# EAGLE design TX (EAGLE 7.3.0)
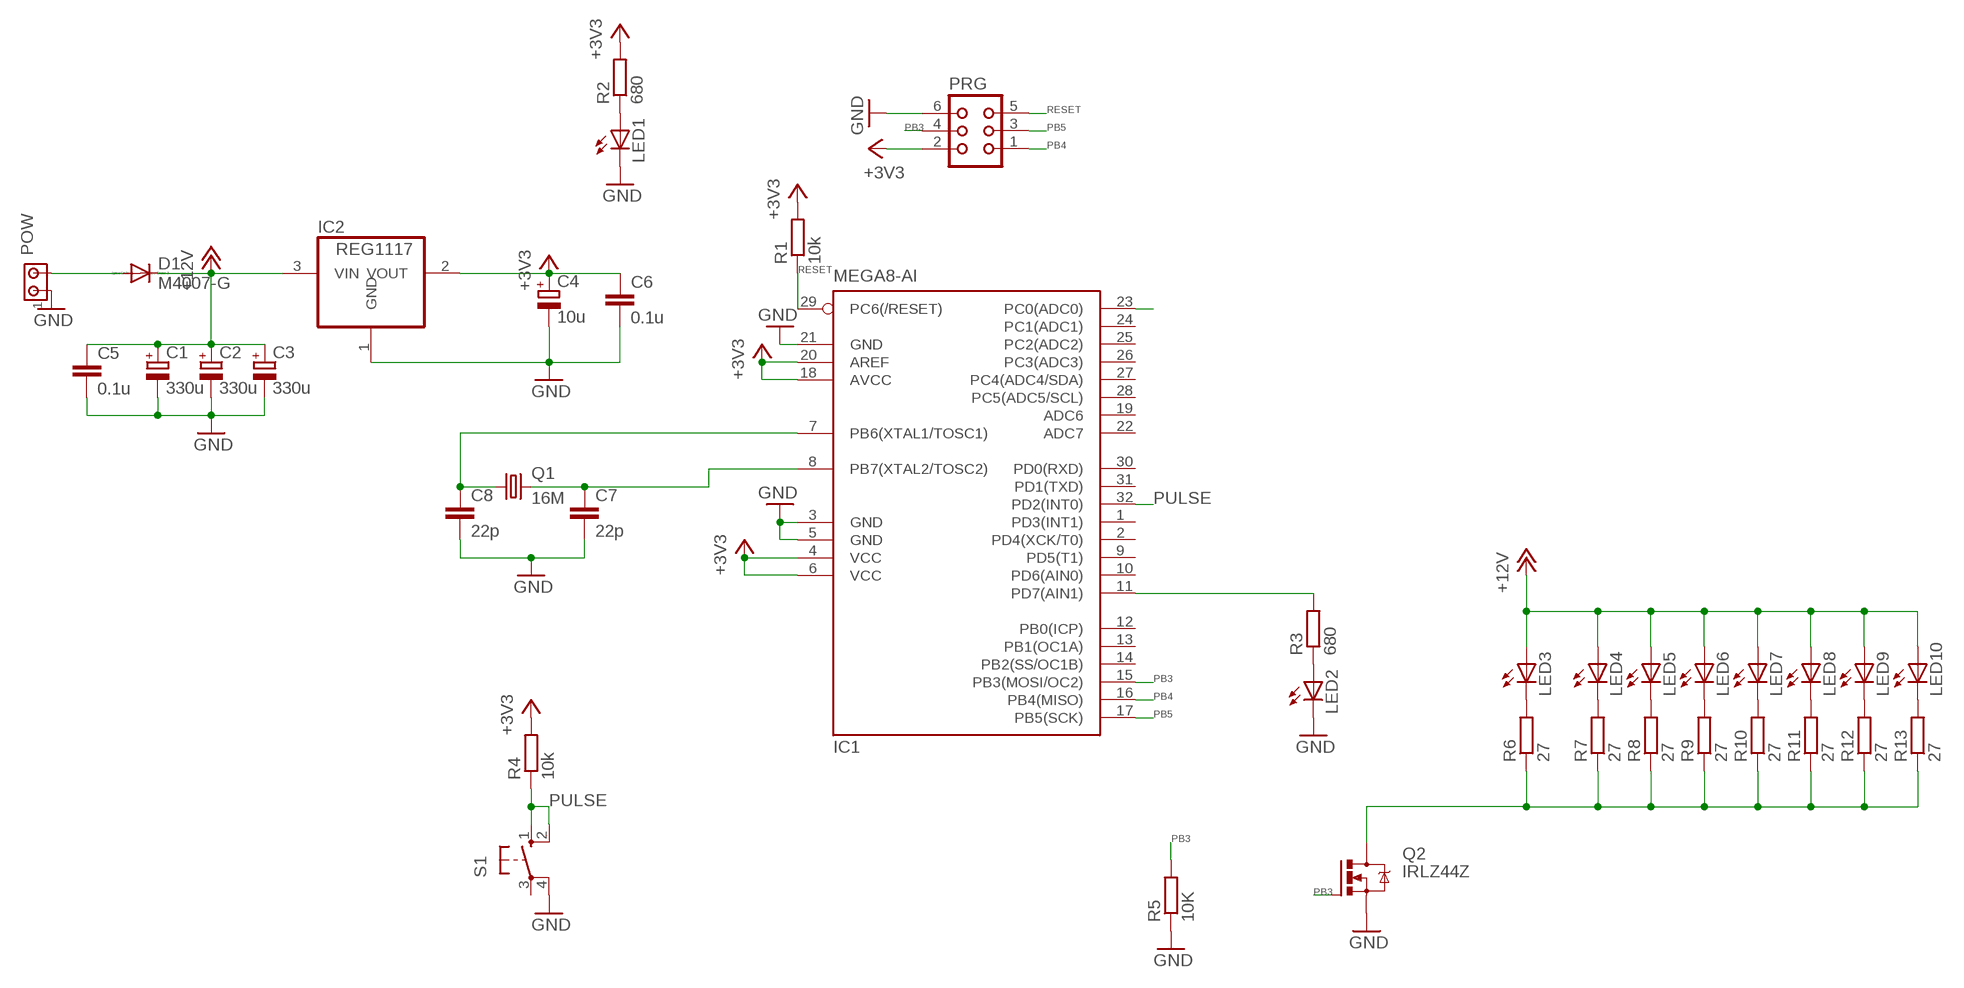
[diagram p0: schematic, sheet 1]

## Parts
C1  330u  CPOL-EU140CLH-1010  [140CLH-1010]
C2  330u  CPOL-EU140CLH-1010  [140CLH-1010]
C3  330u  CPOL-EU140CLH-1010  [140CLH-1010]
C4  10u  CPOL-EU140CLH-0810  [140CLH-0810]
C5  0.1u  C-EUC0402  [C0402]
C6  0.1u  C-EUC0402  [C0402]
C7  22p  C-EUC0805  [C0805]
C8  22p  C-EUC0805  [C0805]
D1  M4007-G  CGRM4007-G  [SOD-123_MINI-SMA]
IC1  MEGA8-AI  [TQFP32-08]
IC2  REG1117  [SOT223]
LED1  LED5MM  [LED5MM]
LED2  LED5MM  [LED5MM]
LED3  LED5MM  [LED5MM]
LED4  LED5MM  [LED5MM]
LED5  LED5MM  [LED5MM]
LED6  LED5MM  [LED5MM]
LED7  LED5MM  [LED5MM]
LED8  LED5MM  [LED5MM]
LED9  LED5MM  [LED5MM]
LED10  LED5MM  [LED5MM]
POW  MTA02-100  [10X02MTA]
PRG  CON06  [CON06]
Q1  16M  CRYSTALHC49UP  [HC49UP]
Q2  IRLZ44Z  [TO220BH]
R1  10k  R-EU_M1206  [M1206]
R2  680  R-EU_M1206  [M1206]
R3  680  R-EU_M1206  [M1206]
R4  10k  R-EU_M1206  [M1206]
R5  10K  R-EU_M1206  [M1206]
R6  27  R-EU_0204/7  [0204/7]
R7  27  R-EU_0204/7  [0204/7]
R8  27  R-EU_0204/7  [0204/7]
R9  27  R-EU_0204/7  [0204/7]
R10  27  R-EU_0204/7  [0204/7]
R11  27  R-EU_0204/7  [0204/7]
R12  27  R-EU_0204/7  [0204/7]
R13  27  R-EU_0204/7  [0204/7]
S1  10-XX  [B3F-10XX]

## Nets
+3V3: C4.+ C6.1 IC1.4(VCC) IC1.6(VCC) IC1.18(AVCC) IC1.20(AREF) IC2.2(VOUT) PRG.2 R1.2 R2.2 R4.2
+12V: C1.+ C2.+ C3.+ C5.1 D1.C IC2.3(VIN) LED3.A LED4.A LED5.A LED6.A LED7.A LED8.A LED9.A LED10.A
GND: C1.- C2.- C3.- C4.- C5.2 C6.2 C7.2 C8.2 IC1.3(GND) IC1.5(GND) IC1.21(GND) IC2.1(GND) LED1.K(C) LED2.K(C) POW.1 PRG.6 Q2.S R5.1 S1.4(P1)
N$1: LED3.K(C) R6.2
N$2: LED1.A R2.1
N$3: IC1.11(PD7(AIN1)) R3.2
N$4: LED2.A R3.1
N$5: LED4.K(C) R7.2
N$6: C8.1 IC1.7(PB6(XTAL1/TOSC1)) Q1.1
N$7: C7.1 IC1.8(PB7(XTAL2/TOSC2)) Q1.2
N$8: LED5.K(C) R8.2
N$9: LED6.K(C) R9.2
N$10: LED7.K(C) R10.2
N$11: LED8.K(C) R11.2
N$12: LED9.K(C) R12.2
N$13: LED10.K(C) R13.2
N$14: IC1.23(PC0(ADC0))
N$15: Q2.D R6.1 R7.1 R8.1 R9.1 R10.1 R11.1 R12.1 R13.1
N$16: D1.A POW.2
PB3: IC1.15(PB3(MOSI/OC2)) PRG.4 Q2.G R5.2
PB4: IC1.16(PB4(MISO)) PRG.1
PB5: IC1.17(PB5(SCK)) PRG.3
PULSE: IC1.32(PD2(INT0)) R4.1 S1.1(S) S1.2(S1)
RESET: IC1.29(PC6(/RESET)) PRG.5 R1.1
Unconnected: IC1.1(PD3(INT1)) IC1.2(PD4(XCK/T0)) IC1.9(PD5(T1)) IC1.10(PD6(AIN0)) IC1.12(PB0(ICP)) IC1.13(PB1(OC1A)) IC1.14(PB2(SS/OC1B)) IC1.19(ADC6) IC1.22(ADC7) IC1.24(PC1(ADC1)) IC1.25(PC2(ADC2)) IC1.26(PC3(ADC3)) IC1.27(PC4(ADC4/SDA)) IC1.28(PC5(ADC5/SCL)) IC1.30(PD0(RXD)) IC1.31(PD1(TXD)) S1.3(P)

## Library data of the parts
C1-C4 = rcl:CPOL-EU: POLARIZED CAPACITOR, European symbol
C5-C8 = rcl:C-EU: CAPACITOR, European symbol
D1 = diode:CGRM400*-G: Molded plasitc,JEDEC SOD-123/Mini SMA Source: Comchip CGRM4001-G.pdf
IC1 = atmel:MEGA8: MICROCONTROLLER 8 Kbytes FLASH, 1 kbytes SRAM, 512 bytes EEPROM, USART, 6-channel 10 bit ADC, 2-channel 8 bit ADC Pin compatible with Atmega48, ATMega88, ATMega168 Source: avr.lbr; MPN: ATMEGA8-16AU; OC_FARNELL: 9171371; OC_NEWARK: 73M8863
IC2 = burr-brown:REG1117: 800mA and 1A Low Dropout (LDO) Positive Regulator 1.8V, 2.5V, 2.85V, 3.3V, 5V, and Adj; MPN: REG1117; OC_FARNELL: 1097566; OC_NEWARK: 14P6981
LED1-LED10 = led:LED: LED OSRAM: - CHIPLED LG R971, LG N971, LY N971, LG Q971, LY Q971, LO R971, LY R971 LH N974, LH R974 LS Q976, LO Q976, LY Q976 LO Q996 - Hyper CHIPLED LW Q18S LB Q993, LB Q99A, LB R99A - SideLED LS A670, LO A670, LY A670, LG A670, LP A670 LB A673, LV A673, LT A673, LW A673 LH A674 LY A675 LS A676, LA A676, LO A676, LY A676, LW A676 LS A679, LY A679, LG A679 - Hyper Micro SIDELED® LS Y876, LA Y876, LO Y876, LY Y876 LT Y87S - SmartLED LW L88C, LW L88S LB L89C, LB L89S, LG L890 LS L89K, LO L89K, LY L89K LS L896, LA L896, LO L896, LY L896 - TOPLED LS T670, LO T670, LY T670, LG T670, LP T670 LSG T670, LSP T670, LSY T670, LOP T670, LYG T670 LG T671, LOG T671, LSG T671 LB T673, LV T673, LT T673, LW T673 LH T674 LS T676, LA T676, LO T676, LY T676, LB T676, LH T676, LSB T676, LW T676 LB T67C, LV T67C, LT T67C, LS T67K, LO T67K, LY T67K, LW E67C LS E67B, LA E67B, LO E67B, LY E67B, LB E67C, LV E67C, LT E67C LW T67C LS T679, LY T679, LG T679 LS T770, LO T770, LY T770, LG T770, LP T770 LB T773, LV T773, LT T773, LW T773 LH T774 LS E675, LA E675, LY E675, LS T675 LS T776, LA T776, LO T776, LY T776, LB T776 LHGB T686 LT T68C, LB T68C - Hyper Mini TOPLED® LB M676 - Mini TOPLED Santana® LG M470 LS M47K, LO M47K, LY M47K Source: http://www.osram.convergy.de LUXEON: - LUMILED® LXK2-PW12-R00, LXK2-PW12-S00, LXK2-PW14-U00, LXK2-PW14-V00 LXK2-PM12-R00, LXK2-PM12-S00, LXK2-PM14-U00 LXK2-PE12-Q00, LXK2-PE12-R00, LXK2-PE12-S00, LXK2-PE14-T00, LXK2-PE14-U00 LXK2-PB12-K00, LXK2-PB12-L00, LXK2-PB12-M00, LXK2-PB14-N00, LXK2-PB14-P00, LXK2-PB14-Q00 LXK2-PR12-L00, LXK2-PR12-M00, LXK2-PR14-Q00, LXK2-PR14-R00 LXK2-PD12-Q00, LXK2-PD12-R00, LXK2-PD12-S00 LXK2-PH12-R00, LXK2-PH12-S00 LXK2-PL12-P00, LXK2-PL12-Q00, LXK2-PL12-R00 Source: www.luxeon.com KINGBRIGHT: KA-3528ASYC Source: www.kingbright.com
POW = con-amp:MTA02-100: AMP connector
PRG = con-harting:CON06: CONNECTOR; OC_FARNELL: unknown; OC_NEWARK: unknown
Q1 = crystal:CRYSTAL: CRYSTAL; OC_FARNELL: unknown; OC_NEWARK: unknown
Q2 = transistor-power:IRLZ44Z: N-Channel HEXFET® Power MOSFET Logic Level AUTOMOTIVE MOSFET Source: http://www.irf.com/product-info/datasheets/data/irlz44zpbf.pdf
R1-R13 = rcl:R-EU_: RESISTOR, European symbol
S1 = switch-omron:10-XX: OMRON SWITCH; MPN: B3F-1000; OC_FARNELL: 176432; OC_NEWARK: 36M3542

## Board
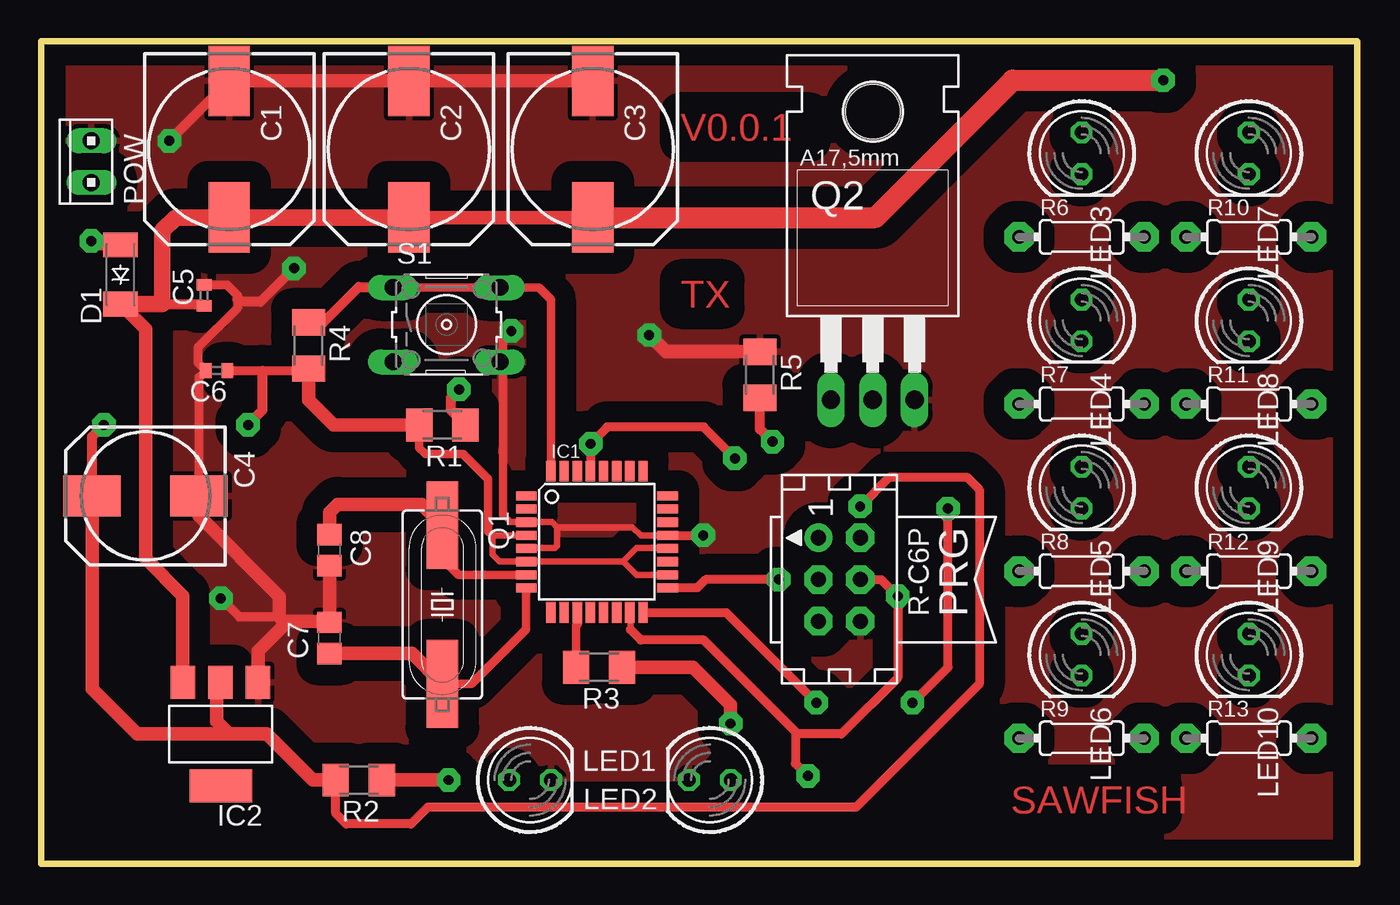
[diagram p1: board, top side]
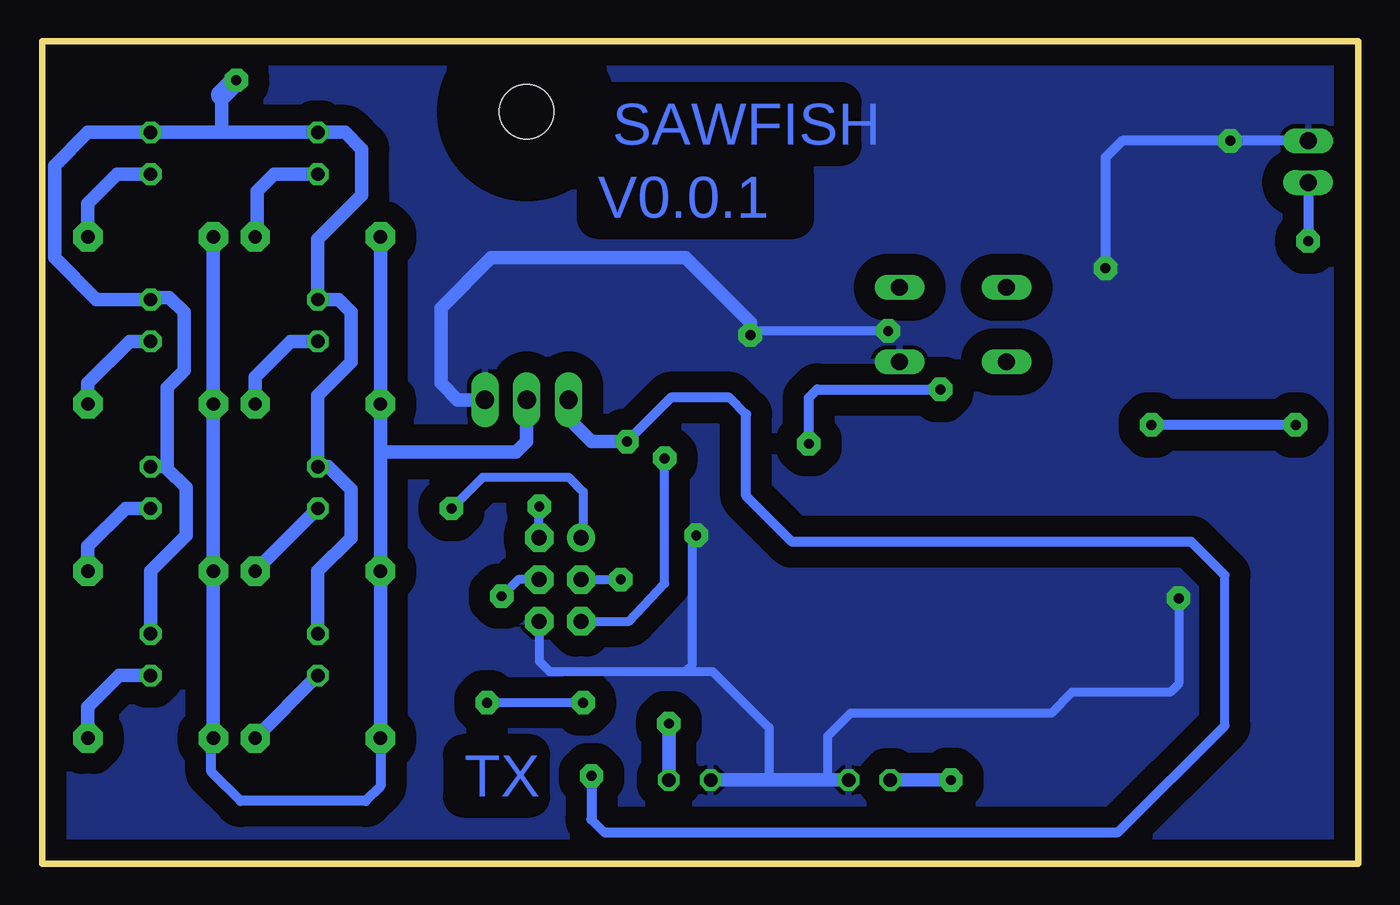
[diagram p2: board, bottom side, seen from below]

Size 80 x 50 mm. Coordinates in mm from the lower left corner, seen from the top.
Outline: 0,0 80,0 80,50 0,50 0,0
Copper layers (1*16): Top 0.035mm / dielectric 1.5mm / Bottom 0.035mm
Design rules "default": minimum track width 10mil, minimum drill 24mil, track to track 8mil, track to pad 8mil, pad to pad 8mil, via to via 8mil, smd to smd 8mil, copper to edge 40mil, drill to drill 8mil, minimum pad ring 10mil, minimum via ring 8mil, stop-mask expansion 4mil, vias tented up to drill 0mil, thermal gap 10mil

### Footprints (pad centres in the part's own frame; a part is rotated, then mirrored left to right if it is on the bottom)
140CLH-1010 = smd 4.3 x 2.5: + 4.15,0; - -4.15,0
140CLH-0810 = smd 3.5 x 2.5: + 3.25,0; - -3.25,0
C0402 = smd 0.7 x 0.9: 1 -0.65,0; 2 0.65,0
C0805 = smd 1.3 x 1.5: 1 -0.95,0; 2 0.95,0
SOD-123_MINI-SMA = smd 1.5 x 2.1: A 1.8,0; C -1.8,0
TQFP32-08 = smd 1.27 x 0.559: 1 -4.293,2.8; 2 -4.293,2; 3 -4.293,1.2; 4 -4.293,0.4; 5 -4.293,-0.4; 6 -4.293,-1.2; 7 -4.293,-2; 8 -4.293,-2.8; 17 4.293,-2.8; 18 4.293,-2; 19 4.293,-1.2; 20 4.293,-0.4; 21 4.293,0.4; 22 4.293,1.2; 23 4.293,2; 24 4.293,2.8 | smd 0.559 x 1.27: 9 -2.8,-4.293; 10 -2,-4.293; 11 -1.2,-4.293; 12 -0.4,-4.293; 13 0.4,-4.293; 14 1.2,-4.293; 15 2,-4.293; 16 2.8,-4.293; 25 2.8,4.293; 26 2,4.293; 27 1.2,4.293; 28 0.4,4.293; 29 -0.4,4.293; 30 -1.2,4.293; 31 -2,4.293; 32 -2.8,4.293
SOT223 = smd 1.499 x 2.007: 1 -2.261,-3.15; 2 0.025,-3.15; 3 2.311,-3.15 | smd 3.81 x 2.007: 4 0,3.15
LED5MM = drill 0.813 octagon: A -1.27,0; K 1.27,0
10X02MTA = drill 1.016 long: 1 1.27,0; 2 -1.27,0
CON06 = drill 0.914 pad 1.727: 1 -2.54,-1.27 | drill 0.914 pad 1.727 octagon: 2 -2.54,1.27; 3 0,-1.27; 4 0,1.27; 5 2.54,-1.27; 6 2.54,1.27
HC49UP = smd 5.334 x 1.93: 1 -4.826,0; 2 4.826,0
TO220BH = drill 1.118 long: D 0,-6.35; G -2.54,-6.35; S 2.54,-6.35 | hole 3.302: 0,11.176
M1206 = smd 1.6 x 2: 1 -1.4,0; 2 1.4,0
0204/7 = drill 0.813 pad 1.778 octagon: 1 -3.81,0; 2 3.81,0
B3F-10XX = drill 1.016 long: 1 -3.251,2.261; 2 3.251,2.261; 3 -3.251,-2.261; 4 3.251,-2.261

### Placement (x,y rotation side)
C1  11.43,43.43 270 top
C2  22.35,43.43 270 top
C3  33.53,43.43 270 top
C4  6.35,22.35 180 top
C5  9.91,34.54 90 top
C6  10.67,29.97 180 top
C7  17.53,13.72 90 top
C8  17.53,19.05 270 top
D1  4.83,35.81 90 top
IC1  33.78,19.56 0 top
IC2  10.92,7.87 180 top
LED1  29.72,5.08 0 top
LED2  40.64,5.08 180 top
LED3  63.25,43.18 270 top
LED4  63.25,33.02 270 top
LED5  63.25,22.86 270 top
LED6  63.25,12.7 270 top
LED7  73.41,43.18 270 top
LED8  73.41,33.02 270 top
LED9  73.41,22.86 270 top
LED10  73.41,12.7 270 top
POW  3.05,42.67 90 top
PRG  48.51,17.27 270 top
Q1  24.38,15.75 270 top
Q2  50.55,34.54 0 top
R1  24.38,26.67 180 top
R2  19.3,5.08 180 top
R3  33.91,11.94 180 top
R4  16.26,31.5 270 top
R5  43.69,29.72 270 top
R6  63.25,38.1 0 top
R7  63.25,27.94 0 top
R8  63.25,17.78 0 top
R9  63.25,7.62 0 top
R10  73.41,38.1 0 top
R11  73.41,27.94 0 top
R12  73.41,17.78 0 top
R13  73.41,7.62 0 top
S1  24.64,32.77 0 top

### Tracks (layer width: path | path; a pad name or v marks a point on that pad's centre or on a via)
+3V3  (via drill 0.6 pad 1.42)
  Top 0.406: 29.47,19.94 27.43,19.94 27.43,18.8 27.87,18.36 IC1.6 35.38,18.36 | 35.38,18.36 36.2,19.18 38.06,19.18 | IC1.18 36.18,17.56 35.38,18.36
  Top 0.508: R1.2 22.98,25.28 23.37,24.89 25.65,24.89 27.18,23.37 27.18,20.19 27.43,19.94 | 29.47,19.94 IC1.4
  Top 0.559: v49.78,21.72 51.56,23.5 56.26,23.5 57.02,22.73 57.02,10.92 49.53,3.43 23.5,3.43 22.48,2.41 18.54,2.41 17.91,3.05 R2.2 | 38.06,19.18 IC1.20 | C6.1 13.46,29.97 16.13,29.97 R4.2
  Top 0.61: C4.+ 3.1,25.96 v3.81,26.67 | v12.57,26.67 13.46,27.56 13.46,29.97
  Top 0.813: R2.2 16.51,5.08 13.72,7.87 11.43,7.87 | 11.43,7.87 10.67,8.64 10.67,10.79 IC2.2 | C4.+ 3.1,10.62 5.84,7.87 11.43,7.87 | R1.2 17.78,26.67 16.26,28.19 R4.2
  Bottom 0.559: PRG.2 v49.78,21.72
  Bottom 0.61: v3.81,26.67 v12.57,26.67
+12V  (via drill 0.6 pad 1.42)
  Top 0.61: 7.37,34.01 9.79,34.01 C5.1
  Top 0.813: IC2.3 8.61,16.28 6.35,18.54 6.35,32.49 D1.C | C2.+ C3.+
  Top 1.016: D1.C 7.37,34.01 7.37,38.48 8.17,39.28 C1.+ C2.+
  Top 1.27: C3.+ 50.71,39.28 59.05,47.62 v68.2,47.62
  Bottom 0.813: 68.96,44.45 LED3.A 61.59,44.45 60.58,43.43 60.58,40.64 63.25,37.97 LED4.A 61.98,34.29 61.21,33.53 61.21,30.48 63.25,28.45 LED5.A 62.61,24.13 61.21,22.73 61.21,19.81 63.25,17.78 LED6.A | 68.96,44.45 LED7.A 77.22,44.45 79.25,42.42 79.25,36.83 76.71,34.29 LED8.A 73.28,34.42 72.26,34.42 71.37,33.53 71.37,29.97 72.39,28.96 72.39,24 | LED10.A 73.41,17.78 71.25,19.94 71.25,22.86 72.39,24 | 72.39,24 72.52,24.13 LED9.A | 69.09,46.74 69.09,44.58 68.96,44.45
  Bottom 1.27: v68.2,47.62 69.09,46.74
GND  (via drill 0.6 pad 1.42)
  Top 0.406: 31.37,20.45 31.06,20.76 IC1.3 28.52,20.76 28.07,21.21 | 31.37,20.45 31.37,19.3 31.24,19.18 29.51,19.18 | 31.37,20.45 35.94,20.45 36.45,19.94 38.06,19.94
  Top 0.508: 29.51,19.18 IC1.5 | 28.07,21.21 28.07,30.33 S1.4
  Top 0.559: 38.06,19.94 IC1.21 v40.24,19.96 | 28.07,30.33 28.07,31.88 v28.57,32.38 | C4.- 9.6,29.55 C6.2 9.53,30.46 9.53,31.37 11.94,33.78 11.94,34.29 11.94,34.54 11.29,35.19 C5.2 | C8.2 17.53,14.73 17.4,14.61 14.86,14.61 | 14.48,14.99 12.06,14.99 v10.92,16.13
  Top 0.61: v7.79,43.94 C1.- | v15.37,36.2 13.34,34.16 12.06,34.16 11.94,34.29
  Top 0.813: IC2.1 13.18,12.93 14.86,14.61 | 14.86,14.61 14.99,14.73 17.46,14.73 C7.2 C8.2 | C4.- 9.6,21.13 14.48,16.26 14.48,14.99 14.86,14.61 | C1.- C2.- C3.- | v36.96,32.13 37.97,31.11 R5.1
  Bottom 0.559: PRG.6 49.78,12.32 49.15,11.68 40.89,11.68 | 40.89,11.68 39.24,11.68 35.81,8.26 35.81,5.21 35.94,5.08 | v40.24,19.96 40.51,19.68 40.51,12.06 40.89,11.68 | v28.57,32.38 36.7,32.38 v36.96,32.13 | v10.92,16.13 10.92,10.92 11.43,10.41 17.4,10.41 18.67,9.14 30.86,9.14 32.26,7.75 32.26,5.21 32.13,5.08
  Bottom 0.61: POW.1 v7.79,43.94 14.35,43.94 15.37,42.93 v15.37,36.2
  Bottom 0.813: LED1.K 32.13,5.08 35.94,5.08 LED2.K | Q2.S 54.74,28.19 55.75,29.21 55.75,33.78 52.7,36.83 40.89,36.83 36.96,32.89 v36.96,32.13
  pour Bottom (isolate 1.27): -5,55 -5,-5 85,-5 85,55
  pour Top (isolate 1.27): -5,55 -5,-5 85,-5 85,55
N$1
  Bottom 0.813: LED3.K 65.91,41.91 66.93,40.89 66.93,38.23 R6.2
N$2  (via drill 0.6 pad 1.42)
  Top 0.813: v24.77,5.08 R2.1
  Bottom 0.813: LED1.A v24.77,5.08
N$3
  Top 0.406: 32.64,14.61 32.64,15.21
  Top 0.508: R3.2 32.51,14.47 32.64,14.61 | 32.64,15.21 IC1.11
N$4  (via drill 0.6 pad 1.42)
  Top 0.813: v41.91,8.51 41.91,9.65 39.62,11.94 R3.1
  Bottom 0.813: LED2.A v41.91,8.51
N$5
  Bottom 0.813: R7.2 67.06,29.59 64.9,31.75 LED4.K
N$6
  Top 0.508: IC1.7 25.37,17.56 24.38,18.54 Q1.1
  Top 0.813: C8.1 17.53,21.34 18.03,21.84 23.11,21.84 Q1.1
N$7
  Top 0.508: Q1.2 26.16,10.92 29.46,14.22 29.46,16.73 IC1.8
  Top 0.813: C7.1 22.54,12.77 Q1.2
N$8
  Bottom 0.813: R8.2 LED5.K
N$9
  Bottom 0.813: R9.2 LED6.K
N$10
  Bottom 0.813: R10.2 77.22,40.13 75.44,41.91 LED7.K
N$11
  Bottom 0.813: R11.2 77.22,29.21 74.68,31.75 LED8.K
N$12
  Bottom 0.813: R12.2 77.22,19.3 74.93,21.59 LED9.K
N$13
  Bottom 0.813: R13.2 77.22,9.53 75.31,11.43 LED10.K
N$15
  Bottom 0.61: R6.1 59.44,4.7 60.33,3.81 67.94,3.81 69.72,5.59 69.72,7.49 R13.1
  Bottom 0.813: R13.1 R12.1 R11.1 R10.1 | R9.1 R8.1 59.44,25.02 | 59.44,25.02 R7.1 R6.1 | Q2.D 50.55,25.65 51.18,25.02 59.44,25.02
N$16  (via drill 0.6 pad 1.42)
  Top 0.61: v3.05,37.85 3.3,37.59 4.8,37.59 D1.A
  Bottom 0.61: POW.2 v3.05,37.85
PB3  (via drill 0.6 pad 1.42)
  Top 0.406: 35.81,14.22 35.81,15.23 IC1.15
  Top 0.559: 45.85,8 40.26,13.59 36.45,13.59 35.81,14.22 | PRG.4 51.05,17.27 v52.07,16.26 52.07,11.3 48.64,7.87 45.97,7.87 45.85,8 | 45.85,8 45.85,6.1 v46.61,5.33
  Top 0.61: v44.45,25.65 43.69,26.42 R5.2
  Bottom 0.559: PRG.4 51.05,17.27 v52.07,16.26 | 46.61,2.67 45.85,1.91 | 8.13,8.38 8.13,17.53 | 37.21,27.3 38.23,28.32
  Bottom 0.61: v46.61,5.33 46.61,2.67 | 45.85,1.91 14.61,1.91 8.13,8.38 | 8.13,17.53 10.16,19.56 34.42,19.56 37.21,22.35 37.21,27.3 | 38.23,28.32 41.78,28.32 v44.45,25.65
  Bottom 0.813: Q2.G 48.01,27.05 46.61,25.65 v44.45,25.65
PB4  (via drill 0.6 pad 1.42)
  Top 0.559: IC1.16 41.63,15.27 v47.12,9.78 | v52.96,9.78 55.12,11.94 v55.12,21.59
  Bottom 0.559: v47.12,9.78 v52.96,9.78 | v55.12,21.59 53.21,23.5 48.01,23.5 47.12,22.61 47.12,19.94 PRG.1
PB5  (via drill 0.6 pad 1.42)
  Top 0.559: v44.83,17.27 40.39,17.27 39.88,16.76 38.08,16.76 IC1.17
  Bottom 0.559: PRG.3 v44.83,17.27
PULSE
  Top 0.508: S1.1 S1.2 30.25,35.03 30.99,34.29 IC1.32
  Top 0.61: R4.1 17.15,32.9 19.3,35.05 21.36,35.05 S1.1
RESET  (via drill 0.6 pad 1.42)
  Top 0.559: v42.16,24.64 40.26,26.54 34.42,26.54 v33.4,25.53 33.4,23.87 IC1.29
  Top 0.61: v25.4,28.83 24.89,28.32 24.89,27.56 R1.1
  Bottom 0.559: PRG.5 44.32,14.73 42.16,17.02 v42.16,24.64
  Bottom 0.61: v33.4,25.53 33.4,28.32 32.89,28.83 v25.4,28.83

### Text on the board
Top: V0.0.1 | TX | SAWFISH
Bottom: SAWFISH | V0.0.1 | TX